# EAGLE design ANDS 2610 Lensmount (EAGLE 7.3.0)
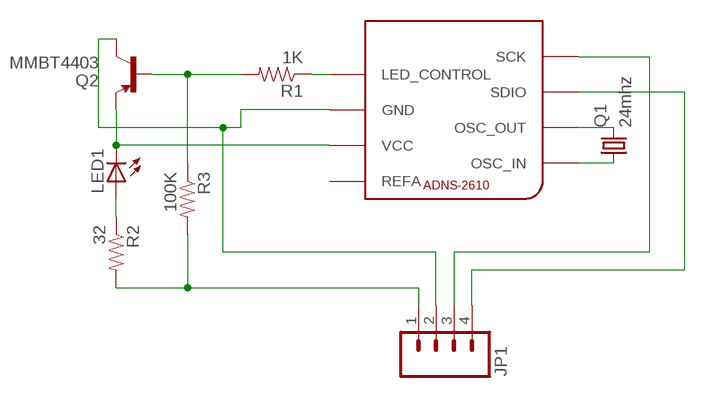
[diagram p0: schematic, sheet 1]

## Parts
JP1  M04PTH  [1X04]
LED1  LED3MM  [LED3MM]
Q1  24mhz  CRYSTALHC49S  [HC49/S]
Q2  MMBT4403  TRANSISTOR_PNPMMBT4403  [SOT23-3]
R1  1K  RESISTOR1206  [1206]
R2  32  RESISTOR1206  [1206]
R3  100K  RESISTOR1206  [1206]
U$1  ADNS-2610  [ADNS-2610]

## Nets
N$1: Q2.1(B) R1.2 R3.1
N$2: R1.1 U$1.LED_CONTROL
N$3: JP1.2 Q2.3(C) U$1.GND
N$4: JP1.1 R2.2 R3.2
N$5: LED1.K(C) Q2.2(E) U$1.VCC
N$6: LED1.A R2.1
N$7: Q1.2 U$1.OSC_OUT
N$8: Q1.1 U$1.OSC_IN
N$9: JP1.3 U$1.SCK
N$10: JP1.4 U$1.SDIO
Unconnected: U$1.REFA

## Library data of the parts
JP1 = SparkFun-Connectors:M04: Header 4 Standard 4-pin 0.1" header. Use with straight break away headers (SKU : PRT-00116), right angle break away headers (PRT-00553), swiss pins (PRT-00743), machine pins (PRT-00117), and female headers (PRT-00115). Molex polarized connector foot print use with SKU : PRT-08231 with associated crimp pins and housings. 1MM SMD Version SKU: PRT-10208
LED1 = adafruit:LED: LED OSRAM: - CHIPLED LG R971, LG N971, LY N971, LG Q971, LY Q971, LO R971, LY R971 LH N974, LH R974 LS Q976, LO Q976, LY Q976 LO Q996 - Hyper CHIPLED LW Q18S LB Q993, LB Q99A, LB R99A - SideLED LS A670, LO A670, LY A670, LG A670, LP A670 LB A673, LV A673, LT A673, LW A673 LH A674 LY A675 LS A676, LA A676, LO A676, LY A676, LW A676 LS A679, LY A679, LG A679 - Hyper Micro SIDELED® LS Y876, LA Y876, LO Y876, LY Y876 LT Y87S - SmartLED LW L88C, LW L88S LB L89C, LB L89S, LG L890 LS L89K, LO L89K, LY L89K LS L896, LA L896, LO L896, LY L896 - TOPLED LS T670, LO T670, LY T670, LG T670, LP T670 LSG T670, LSP T670, LSY T670, LOP T670, LYG T670 LG T671, LOG T671, LSG T671 LB T673, LV T673, LT T673, LW T673 LH T674 LS T676, LA T676, LO T676, LY T676, LB T676, LH T676, LSB T676, LW T676 LB T67C, LV T67C, LT T67C, LS T67K, LO T67K, LY T67K, LW E67C LS E67B, LA E67B, LO E67B, LY E67B, LB E67C, LV E67C, LT E67C LW T67C LS T679, LY T679, LG T679 LS T770, LO T770, LY T770, LG T770, LP T770 LB T773, LV T773, LT T773, LW T773 LH T774 LS E675, LA E675, LY E675, LS T675 LS T776, LA T776, LO T776, LY T776, LB T776 LHGB T686 LT T68C, LB T68C - Hyper Mini TOPLED® LB M676 - Mini TOPLED Santana® LG M470 LS M47K, LO M47K, LY M47K Source: http://www.osram.convergy.de/
Q1 = crystal:CRYSTAL: CRYSTAL; OC_FARNELL: 1667008; OC_NEWARK: unknown
Q2 = SparkFun-DiscreteSemi:TRANSISTOR_PNP: Generic PNP BJT Double check pinouts against datasheets- not all devices are the same! MMBT3906 - 40V 200mA SOT-23 (TRANS-08052) MMBT4403 - 40V 600mA SOT-23 (TRANS-09245); PROD_ID: TRANS-09245
R1-R3 = SparkFun-Passives:RESISTOR: Resistor Basic schematic elements and footprints for 0603, 1206, and PTH resistors.
U$1 = Arsenio:ADNS-2610

## Board
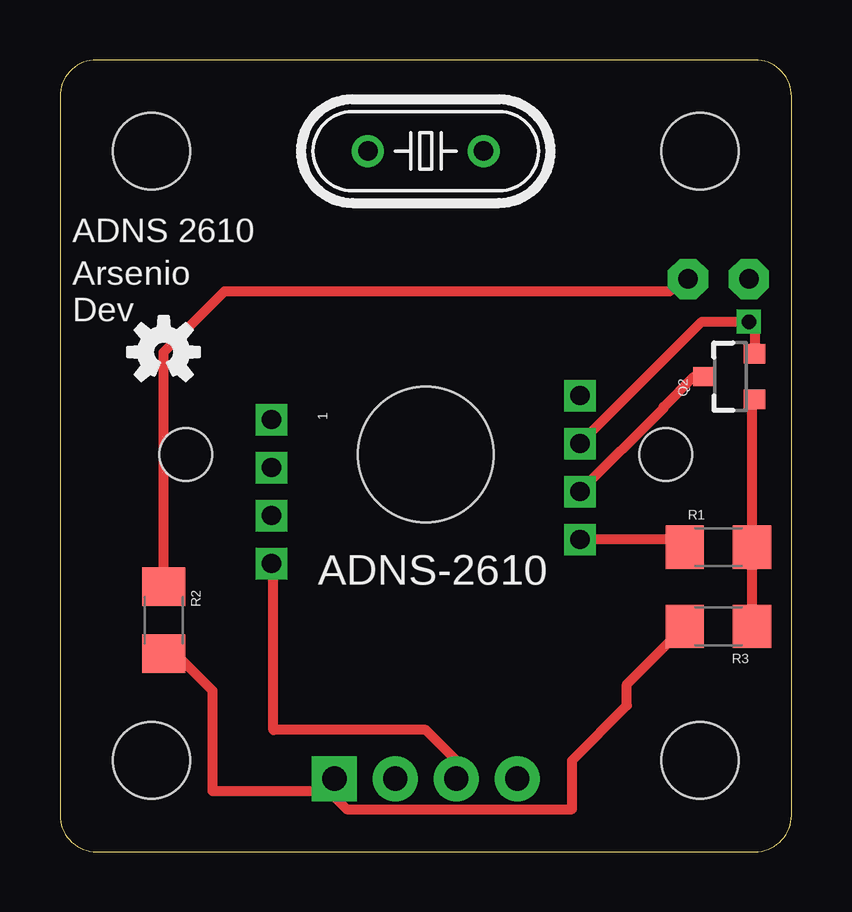
[diagram p1: board, top side]
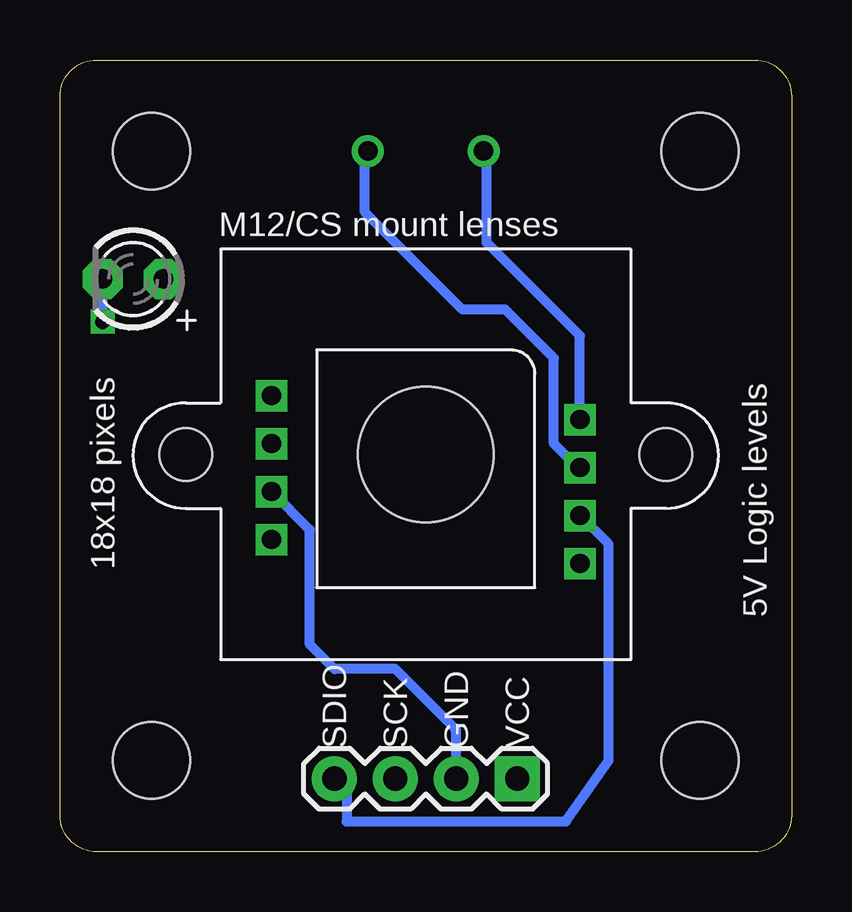
[diagram p2: board, bottom side, seen from below]

Size 30.48 x 33.01 mm. Coordinates in mm from the lower left corner, seen from the top.
Outline: 0,31.49 0,1.52 arc90 1.52,0 28.96,0 arc90 30.48,1.52 30.48,31.49 arc90 28.96,33.01 1.52,33.01 arc90 0,31.49
Copper layers (1*16): Top 0.035mm / dielectric 1.5mm / Bottom 0.035mm
Design rules "default": minimum track width 10mil, minimum drill 24mil, track to track 8mil, track to pad 8mil, pad to pad 8mil, via to via 8mil, smd to smd 8mil, copper to edge 40mil, drill to drill 8mil, minimum pad ring 10mil, minimum via ring 8mil, stop-mask expansion 4mil, vias tented up to drill 0mil, thermal gap 10mil
Holes 3.2 mm at 3.81,29.21 26.67,29.21 26.67,3.81 3.81,3.81

### Footprints (pad centres in the part's own frame; a part is rotated, then mirrored left to right if it is on the bottom)
1X04 = drill 1.016 pad 1.88 square: 1 0,0 | drill 1.016 pad 1.88: 2 2.54,0; 3 5.08,0; 4 7.62,0
LED3MM = drill 0.813 pad 1.676 octagon: A -1.27,0; K 1.27,0
HC49/S = drill 0.813: 1 -2.413,0; 2 2.413,0
SOT23-3 = smd 0.8 x 0.9: 1 -0.95,-1; 2 0.95,-1; 3 0,1.1
1206 = smd 1.6 x 1.8: 1 -1.4,0; 2 1.4,0
ADNS-2610 = drill 0.8 square: GND 2,6.425; LED_CONTROL 4,6.425; OSC_IN -1,-6.425; OSC_OUT 1,-6.425; REFA -2,6.425; SCK 5,-6.425; SDIO 3,-6.425; VCC 0,6.425 | hole 5.65: 0.45,0 | hole 2.2: 0.45,10; 0.45,-10

### Placement (x,y rotation side)
JP1  11.43,3.05 180 bottom
LED1  27.43,23.88 180 bottom
Q1  15.24,29.21 0 top
Q2  27.94,19.81 90 top
R1  27.43,12.7 0 top
R2  4.32,9.65 270 top
R3  27.43,9.4 180 top
U$1  15.24,17.02 270 top
U$2  [OSHW-LOGO-S]  4.32,20.83 0 top

### Tracks (layer width: path | path; a pad name or v marks a point on that pad's centre or on a via)
N$1
  Top 0.406: R3.1 R1.2 28.83,18.75 Q2.1
N$2
  Top 0.406: R1.1 25.71,13.02 U$1.LED_CONTROL
N$3
  Top 0.406: U$1.GND 25.15,18.5 25.15,18.54 26.42,19.81 Q2.3
  Bottom 0.406: JP1.2 13.97,5.08 16.51,7.62 19.05,7.62 20.07,8.64 20.07,13.42 U$1.GND
N$4
  Top 0.406: R3.2 23.62,6.99 23.62,6.1 21.34,3.81 21.34,1.78 11.94,1.78 11.43,2.29 JP1.1 10.92,2.54 6.35,2.54 6.35,6.73 4.83,8.25 R2.2
N$5  (via drill 0.6)
  Top 0.406: U$1.VCC 26.75,22.1 v28.7,22.1 28.94,21.86 Q2.2
  Bottom 0.406: v28.7,22.1 LED1.K
N$6
  Top 0.406: R2.1 4.32,20.83 6.86,23.37 25.4,23.37 LED1.A
N$7
  Bottom 0.406: U$1.OSC_OUT 8.91,16.02 9.91,17.02 9.91,20.57 11.94,22.61 13.72,22.61 17.78,26.67 17.78,29.08 Q1.2
N$8
  Bottom 0.406: U$1.OSC_IN 8.82,21.52 12.7,25.4 12.7,29.08 Q1.1
N$9
  Top 0.406: JP1.3 16.51,3.81 15.24,5.08 8.89,5.08 8.89,11.94 U$1.SCK
N$10
  Bottom 0.406: U$1.SDIO 7.62,12.82 7.62,3.81 9.4,1.27 18.54,1.27 18.54,2.54 JP1.4

### Text on the board
tPlace: ADNS 2610 | Arsenio / Dev
bPlace: M12/CS mount lenses | 5V Logic levels | 18x18 pixels | VCC | GND | SCK | SDIO